# Altium schematic sheet 下载器原理图.SchDoc
size A4
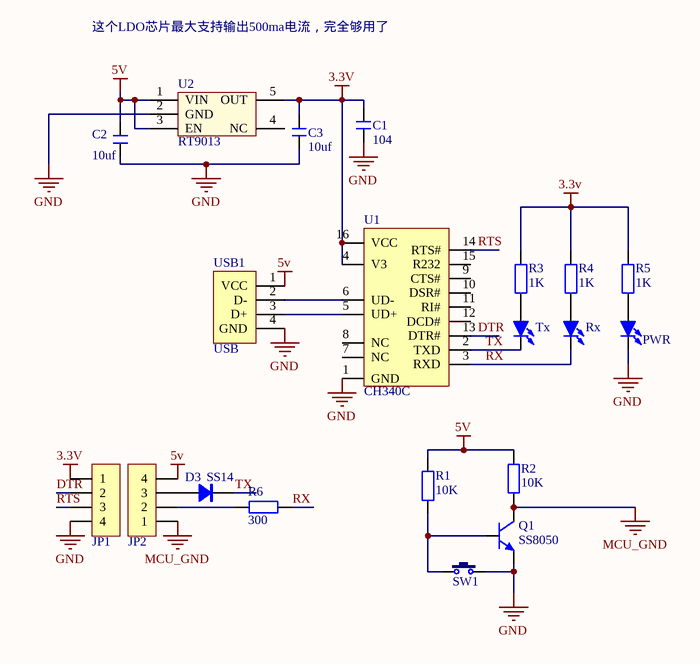
[diagram p0: 下载器原理图.SchDoc]

## Parts
C1  104  [C 0603_L]
C2  10uf  [C 0603_L]
C3  10uf  [C 0603_L]
D3  SS14  [SOD-323]
JP1  HDR-1X4  [2.54_WSPIN_4PIN]  (value not drawn)
JP2  HDR-1X4  [2.54_WSPIN_4PIN]  (value not drawn)
LED1  Tx  [LED 0603B]
LED2  Rx  [LED 0603B]
LED3  PWR  [LED 0603B]
Q1  SS8050  [SOT23-3L]
R1  10K  [R 0603_L]
R2  10K  [R 0603_L]
R3  1K  [R 0603_L]
R4  1K  [R 0603_L]
R5  1K  [R 0603_L]
R6  300  [R 0603_L]
SW1  3x6x5  [SW_1]  (value not drawn)
U1  CH340C  [SOP16_N]
U2  RT9013  [SOT23-5L]
USB1  USB  [USB_A/P_A]

## Nets
3.3v: C1.2 C3.2 JP1.1 R3.2 R4.2 R5.2 U1.4(V3) U1.16(VCC) U2.5(OUT)
5v: C2.2 JP2.4 R1.2 R2.2 U2.1(VIN) U2.3(EN) USB1.1(VCC)
GND: C1.1 C2.1 C3.1 JP1.4 LED3.2(K) Q1.2(E) SW1.1 U1.1(GND) U2.2(GND) USB1.4(GND)
MCU_GND: JP2.1 Q1.3(C) R2.1
DTR: JP1.2 U1.13(DTR#)
RTS: JP1.3 U1.14(RTS#)
RX: LED2.2(K) R6.2 U1.3(RXD)
TX: D3.2(K) LED1.2(K) U1.2(TXD)
NetD3_1: D3.1(A) JP2.3
NetJP2_2: JP2.2 R6.1
NetLED1_1: LED1.1(A) R3.1
NetLED2_1: LED2.1(A) R4.1
NetLED3_1: LED3.1(A) R5.1
NetQ1_1: Q1.1(B) R1.1 SW1.2
NetU1_5: U1.5(UD+) USB1.3(D+)
NetU1_6: U1.6(UD-) USB1.2(D-)

Not connected (* = marked no-connect by the designer): U1 7(NC) 8(NC) 9(CTS#) 10(DSR#) 11(RI#) 12(DCD#) 15(R232); U2 4(NC)

## Notes on the sheet
- 这个LDO芯片最大支持输出500ma电流，完全够用了

## Library data of the parts
C1-C3 = C: 无极性贴片电容; 版权归属: 源创客; BOM名称: 无极性贴片电容; 学习资源: www.ooocke.com
D3 = SS14: 肖特基二极管; 版权归属: 源创客; 属性: 40V/1A; BOM名称: 肖特基二极管; 学习资源: www.ooocke.com
JP1 JP2 = Header 4: 4P接插件; 版权归属: 源创客; BOM名称: 4P接插件; 学习资源: www.ooocke.com
LED1-LED3 = LED-SMD: 贴片LED; 版权归属: 源创客; BOM名称: 贴片LED; 学习资源: www.ooocke.com
Q1 = 8050-SMD: 高频放大-NPN型; 版权归属: 源创客; 属性: 40V 1.5A 1W 100MHZ; BOM名称: 高频放大-NPN型; 学习资源: www.ooocke.com
R1-R6 = R: 贴片电阻; 版权归属: 源创客; BOM名称: 贴片电阻; 学习资源: www.ooocke.com
SW1 = TSW 3x6: 3x6轻触开关; 版权归属: 源创客; BOM名称: 3x6轻触开关; 学习资源: www.ooocke.com
U2 = RT9013_500ma_lDO
USB1 = USB-A/P: USB-A型公接口; 版权归属: 源创客; BOM名称: USB-A型公接口; 学习资源: www.ooocke.com